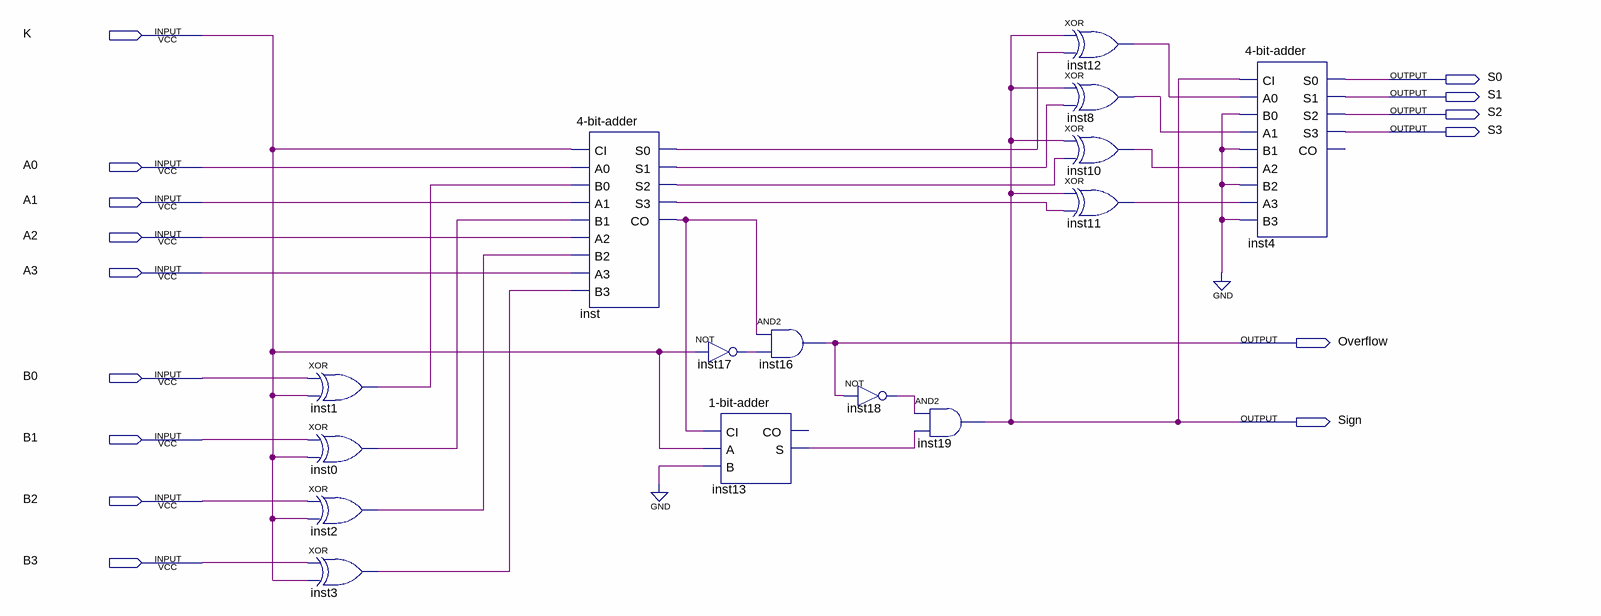
[diagram p0: schematic sheet]
// Quartus schematic 4-bit-adder-subtractor-with-binary-output.bdf as structural Verilog: 15 symbols, 15 pins
module \4-bit-adder-subtractor-with-binary-output  (
  input  K,
  input  A0,
  input  A1,
  input  A2,
  input  A3,
  input  B0,
  input  B1,
  input  B2,
  input  B3,
  output S0,
  output S1,
  output S2,
  output S3,
  output Overflow,
  output Sign
);

  wire inst0_out, inst1_out, inst2_out, inst3_out, inst8_out, inst10_out, inst11_out, inst12_out, inst13_s,
       inst17_out, inst18_out, inst_co, inst_s0, inst_s1, inst_s2, inst_s3;

  xor inst1 (inst1_out, B0, K);
  xor inst0 (inst0_out, B1, K);
  xor inst2 (inst2_out, B2, K);
  xor inst3 (inst3_out, B3, K);
  \4-bit-adder  inst (
    .CI(K), .A0(A0), .B0(inst1_out), .A1(A1), .B1(inst0_out), .A2(A2), .B2(inst2_out), .A3(A3),
    .B3(inst3_out), .S0(inst_s0), .S1(inst_s1), .S2(inst_s2), .S3(inst_s3), .CO(inst_co));
  and inst16 (Overflow, inst_co, inst17_out);
  not inst17 (inst17_out, K);
  \1-bit-adder  inst13 (.CI(inst_co), .A(K), .B(1'b0), .S(inst13_s));  // open: CO
  not inst18 (inst18_out, Overflow);
  and inst19 (Sign, inst18_out, inst13_s);
  xor inst12 (inst12_out, Sign, inst_s0);
  xor inst8 (inst8_out, Sign, inst_s1);
  xor inst10 (inst10_out, Sign, inst_s2);
  xor inst11 (inst11_out, Sign, inst_s3);
  \4-bit-adder  inst4 (
    .CI(Sign), .A0(inst12_out), .B0(1'b0), .A1(inst8_out), .B1(1'b0), .A2(inst10_out), .B2(1'b0),
    .A3(inst11_out), .B3(1'b0), .S0(S0), .S1(S1), .S2(S2), .S3(S3));  // open: CO
endmodule
